# Altium schematic sheet SP485.SchDoc
size A4
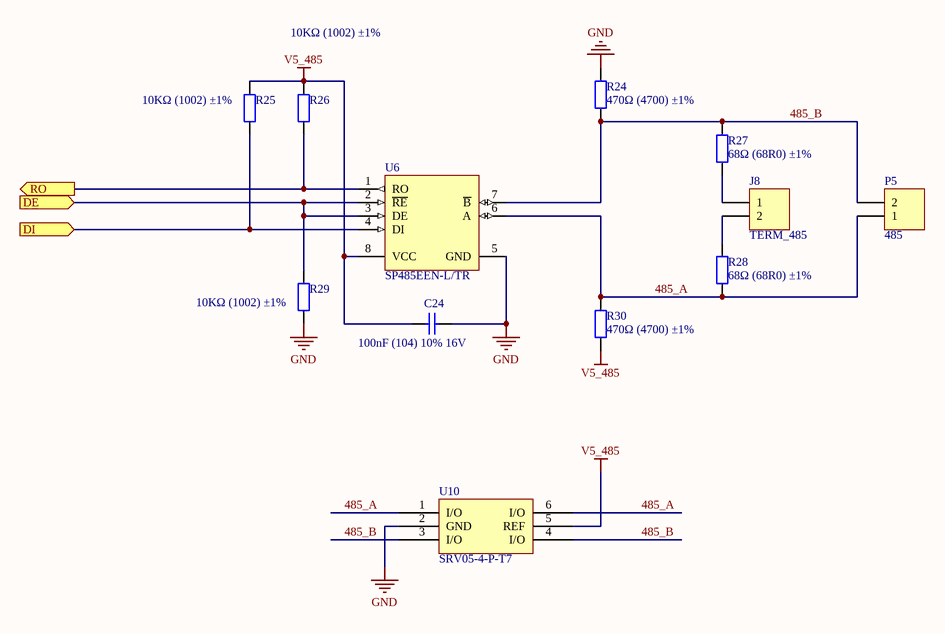
[diagram p0: SP485.SchDoc]

## Parts
C24  100nF (104) 10% 16V  [0402_C]
J8  TERM_485  [HDR1X2]
P5  485  [WJ2EDGRC-5.08-2PxxR]
R24  470Ω (4700) ±1%  [0603_R]
R25  10KΩ (1002) ±1%  [0402_R]
R26  10KΩ (1002) ±1%  [0402_R]
R27  68Ω (68R0) ±1%  [0603_R]
R28  68Ω (68R0) ±1%  [0603_R]
R29  10KΩ (1002) ±1%  [0402_R]
R30  470Ω (4700) ±1%  [0603_R]
U6  SP485EEN-L/TR  [SOIC-8_150mil]
U10  SRV05-4-P-T7  [SOT-23-6]

## Ports
DE (in), DI (in), RO (out)

## Nets
GND: C24.1 R24.2 R29.2 U6.5(GND) U10.2(GND)
V5_485: C24.2 R25.1 R26.1 R30.1 U6.8(VCC) U10.5(REF)
485_A: P5.1 R28.1 R30.2 U6.6(A) U10.1(I/O) U10.6(I/O)
485_B: P5.2 R24.1 R27.2 U6.7(~{B}) U10.3(I/O) U10.4(I/O)
DE: R29.1 U6.2(~{RE}) U6.3(DE) ; port DE
DI: R25.2 U6.4(DI) ; port DI
RO: R26.2 U6.1(RO) ; port RO
NetJ8_1: J8.1 R27.1
NetJ8_2: J8.2 R28.2

## Library data of the parts
C24 = 0402 100nF (104) 10% 16V: 贴片电容; ComponentLink1Description: 供应商链接; ComponentLink1URL: http://www.szlcsc.com/product/details_1877.html; Package: 0402; Supplier: LC; SuppliersPartNumber: C1525
J8 P5 = Header 2: Header, 2-Pin; LatestRevisionDate: 17-Jul-2002; LatestRevisionNote: Re-released for DXP Platform.; Publisher: Altium Limited
R24 R30 = 0603 470Ω (4700) 1%: 贴片电阻; ComponentLink1Description: 供应商链接; ComponentLink1URL: http://www.szlcsc.com/product/details_23906.html; Package: 0603; Supplier: LC; SuppliersPartNumber: C23179
R25 R26 R29 = 0402 10KΩ (1002) 1%: 贴片电阻; ComponentLink1Description: 供应商链接; ComponentLink1URL: http://www.szlcsc.com/product/details_26487.html; Package: 0402; Supplier: LC; SuppliersPartNumber: C25744
R27 R28 = 0603 68Ω (68R0) 1%: 贴片电阻; ComponentLink1Description: 供应商链接; ComponentLink1URL: http://www.szlcsc.com/product/details_28341.html; Package: 0603; Supplier: LC; SuppliersPartNumber: C27592
U6 = SP485EEN-L/TR_[C6855]: RS-485/RS-422; ComponentLink1Description: 供应商链接; ComponentLink1URL: http://www.szlcsc.com/product/details_7327.html; Package: SOIC-8; Supplier: LC; SuppliersPartNumber: C6855
U10 = SRV05-4-P-T7_[C85364]: TVS; ComponentLink1Description: 供应商链接; ComponentLink1URL: http://www.szlcsc.com/product/details_86537.html; Package: SOT-23-6; Supplier: LC; SuppliersPartNumber: C85364